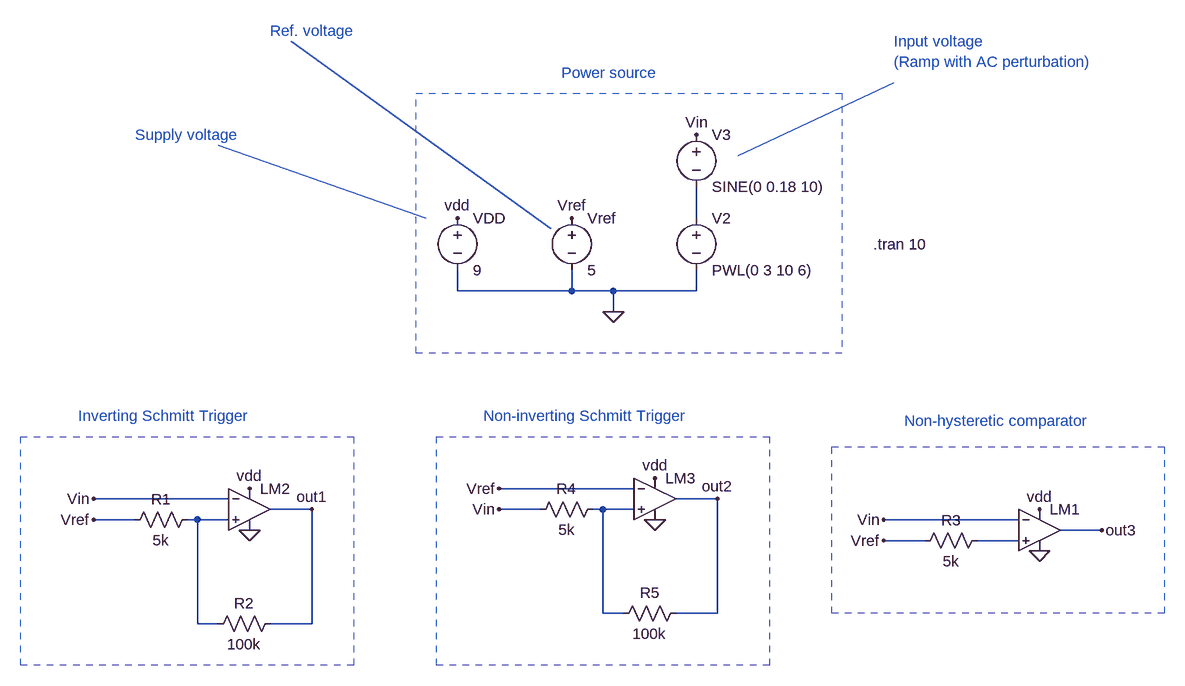
[diagram p0: schematic 1.hysteresis.asc]
1.hysteresis.asc, the LTspice schematic file:
Version 4.1
SHEET 1 2840 680
WIRE 2016 -496 2016 -544
WIRE 1648 -384 1648 -416
WIRE 1824 -384 1824 -416
WIRE 1824 -384 1648 -384
WIRE 1888 -384 1824 -384
WIRE 2016 -384 2016 -416
WIRE 2016 -384 1888 -384
WIRE 1888 -352 1888 -384
WIRE 1920 -80 1712 -80
WIRE 1296 -64 1088 -64
WIRE 2048 -64 1984 -64
WIRE 1424 -48 1360 -48
WIRE 1776 -48 1712 -48
WIRE 1872 -48 1856 -48
WIRE 1920 -48 1872 -48
WIRE 1152 -32 1088 -32
WIRE 1248 -32 1232 -32
WIRE 1296 -32 1248 -32
WIRE 2512 -32 2304 -32
WIRE 2640 -16 2576 -16
WIRE 2368 0 2304 0
WIRE 2512 0 2448 0
WIRE 1872 112 1872 -48
WIRE 1904 112 1872 112
WIRE 2048 112 2048 -64
WIRE 2048 112 1984 112
WIRE 1248 128 1248 -32
WIRE 1280 128 1248 128
WIRE 1424 128 1424 -48
WIRE 1424 128 1360 128
FLAG 1648 -496 vdd
FLAG 1328 -80 vdd
FLAG 1328 -16 0
FLAG 1888 -352 0
FLAG 1824 -496 Vref
FLAG 1088 -32 Vref
FLAG 1088 -64 Vin
FLAG 2016 -624 Vin
FLAG 2544 -48 vdd
FLAG 2544 16 0
FLAG 2304 0 Vref
FLAG 2304 -32 Vin
FLAG 1424 -48 out1
FLAG 2640 -16 out3
FLAG 1952 -96 vdd
FLAG 1952 -32 0
FLAG 1712 -80 Vref
FLAG 1712 -48 Vin
FLAG 2048 -64 out2
SYMBOL OpAmps\\UniversalOpAmp2 1328 -48 R0
SYMATTR InstName LM2
SYMATTR Value2 Avol=140k GBW=1.2Meg Slew=0.5Meg
SYMATTR SpiceLine Ilimit=40m Rail=0 Vos=2.5m
SYMATTR SpiceLine2 En=0 Enk=0 In=0 Ink=0 Rin=10Meg
SYMBOL res 1248 -48 R90
WINDOW 0 0 56 VBottom 2
WINDOW 3 32 56 VTop 2
SYMATTR InstName R1
SYMATTR Value 5k
SYMBOL res 1264 144 R270
WINDOW 0 32 56 VTop 2
WINDOW 3 0 56 VBottom 2
SYMATTR InstName R2
SYMATTR Value 100k
SYMBOL voltage 1824 -512 R0
WINDOW 123 0 0 Left 0
WINDOW 39 0 0 Left 0
SYMATTR InstName Vref
SYMATTR Value 5
SYMBOL voltage 2016 -640 R0
WINDOW 123 0 0 Left 0
WINDOW 39 0 0 Left 0
SYMATTR InstName V3
SYMATTR Value SINE(0 0.18 10)
SYMBOL voltage 1648 -512 R0
WINDOW 123 0 0 Left 0
WINDOW 39 0 0 Left 0
SYMATTR InstName VDD
SYMATTR Value 9
SYMBOL voltage 2016 -512 R0
WINDOW 123 0 0 Left 0
WINDOW 39 0 0 Left 0
SYMATTR InstName V2
SYMATTR Value PWL(0 3 10 6)
SYMBOL OpAmps\\UniversalOpAmp2 2544 -16 R0
SYMATTR InstName LM1
SYMATTR Value2 Avol=140k GBW=1.2Meg Slew=0.5Meg
SYMATTR SpiceLine Ilimit=40m Rail=0 Vos=2.5m
SYMATTR SpiceLine2 En=0 Enk=0 In=0 Ink=0 Rin=10Meg
SYMBOL res 2464 -16 R90
WINDOW 0 0 56 VBottom 2
WINDOW 3 32 56 VTop 2
SYMATTR InstName R3
SYMATTR Value 5k
SYMBOL OpAmps\\UniversalOpAmp2 1952 -64 R0
SYMATTR InstName LM3
SYMATTR Value2 Avol=140k GBW=1.2Meg Slew=0.5Meg
SYMATTR SpiceLine Ilimit=40m Rail=0 Vos=2.5m
SYMATTR SpiceLine2 En=0 Enk=0 In=0 Ink=0 Rin=10Meg
SYMBOL res 1872 -64 R90
WINDOW 0 0 56 VBottom 2
WINDOW 3 32 56 VTop 2
SYMATTR InstName R4
SYMATTR Value 5k
SYMBOL res 1888 128 R270
WINDOW 0 32 56 VTop 2
WINDOW 3 0 56 VBottom 2
SYMATTR InstName R5
SYMATTR Value 100k
TEXT 2288 -456 Left 2 !.tran 10
TEXT 1064 -192 Left 2 ;Inverting Schmitt Trigger
TEXT 2336 -184 Left 2 ;Non-hysteretic comparator
TEXT 1808 -720 Left 2 ;Power source
TEXT 1360 -784 Left 2 ;Ref. voltage
TEXT 1152 -624 Left 2 ;Supply voltage
TEXT 2320 -768 Left 2 ;Input voltage\n(Ramp with AC perturbation)
TEXT 1688 -192 Left 2 ;Non-inverting Schmitt Trigger
LINE Normal 1280 -608 1600 -496
LINE Normal 1392 -768 1792 -480
LINE Normal 2080 -592 2320 -704
RECTANGLE Normal 1488 192 976 -160 2
RECTANGLE Normal 2736 112 2224 -144 2
RECTANGLE Normal 2240 -288 1584 -688 2
RECTANGLE Normal 2128 192 1616 -160 2

The netlist it stands for:
* 1.hysteresis.asc
X§LM2 N003 Vin vdd 0 out1 level2 Avol=140k GBW=1.2Meg Slew=0.5Meg Ilimit=40m Rail=0 Vos=2.5m En=0 Enk=0 In=0 Ink=0 Rin=10Meg  ; pins In+ In- V+ V- OUT
R1 N003 Vref 5k
R2 N003 out1 100k
Vref Vref 0 5
V3 Vin N001 SINE(0 0.18 10)
VDD vdd 0 9
V2 N001 0 PWL(0 3 10 6)
X§LM1 N004 Vin vdd 0 out3 level2 Avol=140k GBW=1.2Meg Slew=0.5Meg Ilimit=40m Rail=0 Vos=2.5m En=0 Enk=0 In=0 Ink=0 Rin=10Meg  ; pins In+ In- V+ V- OUT
R3 N004 Vref 5k
X§LM3 N002 Vref vdd 0 out2 level2 Avol=140k GBW=1.2Meg Slew=0.5Meg Ilimit=40m Rail=0 Vos=2.5m En=0 Enk=0 In=0 Ink=0 Rin=10Meg  ; pins In+ In- V+ V- OUT
R4 N002 Vin 5k
R5 N002 out2 100k
.tran 10
* Inverting Schmitt Trigger
* Non-hysteretic comparator
* Power source
* Ref. voltage
* Supply voltage
* Input voltage
* (Ramp with AC perturbation)
* Non-inverting Schmitt Trigger
.lib UniversalOpAmp2.lib
.backanno
.end